# EAGLE design source_eagle (EAGLE 9.6.2)
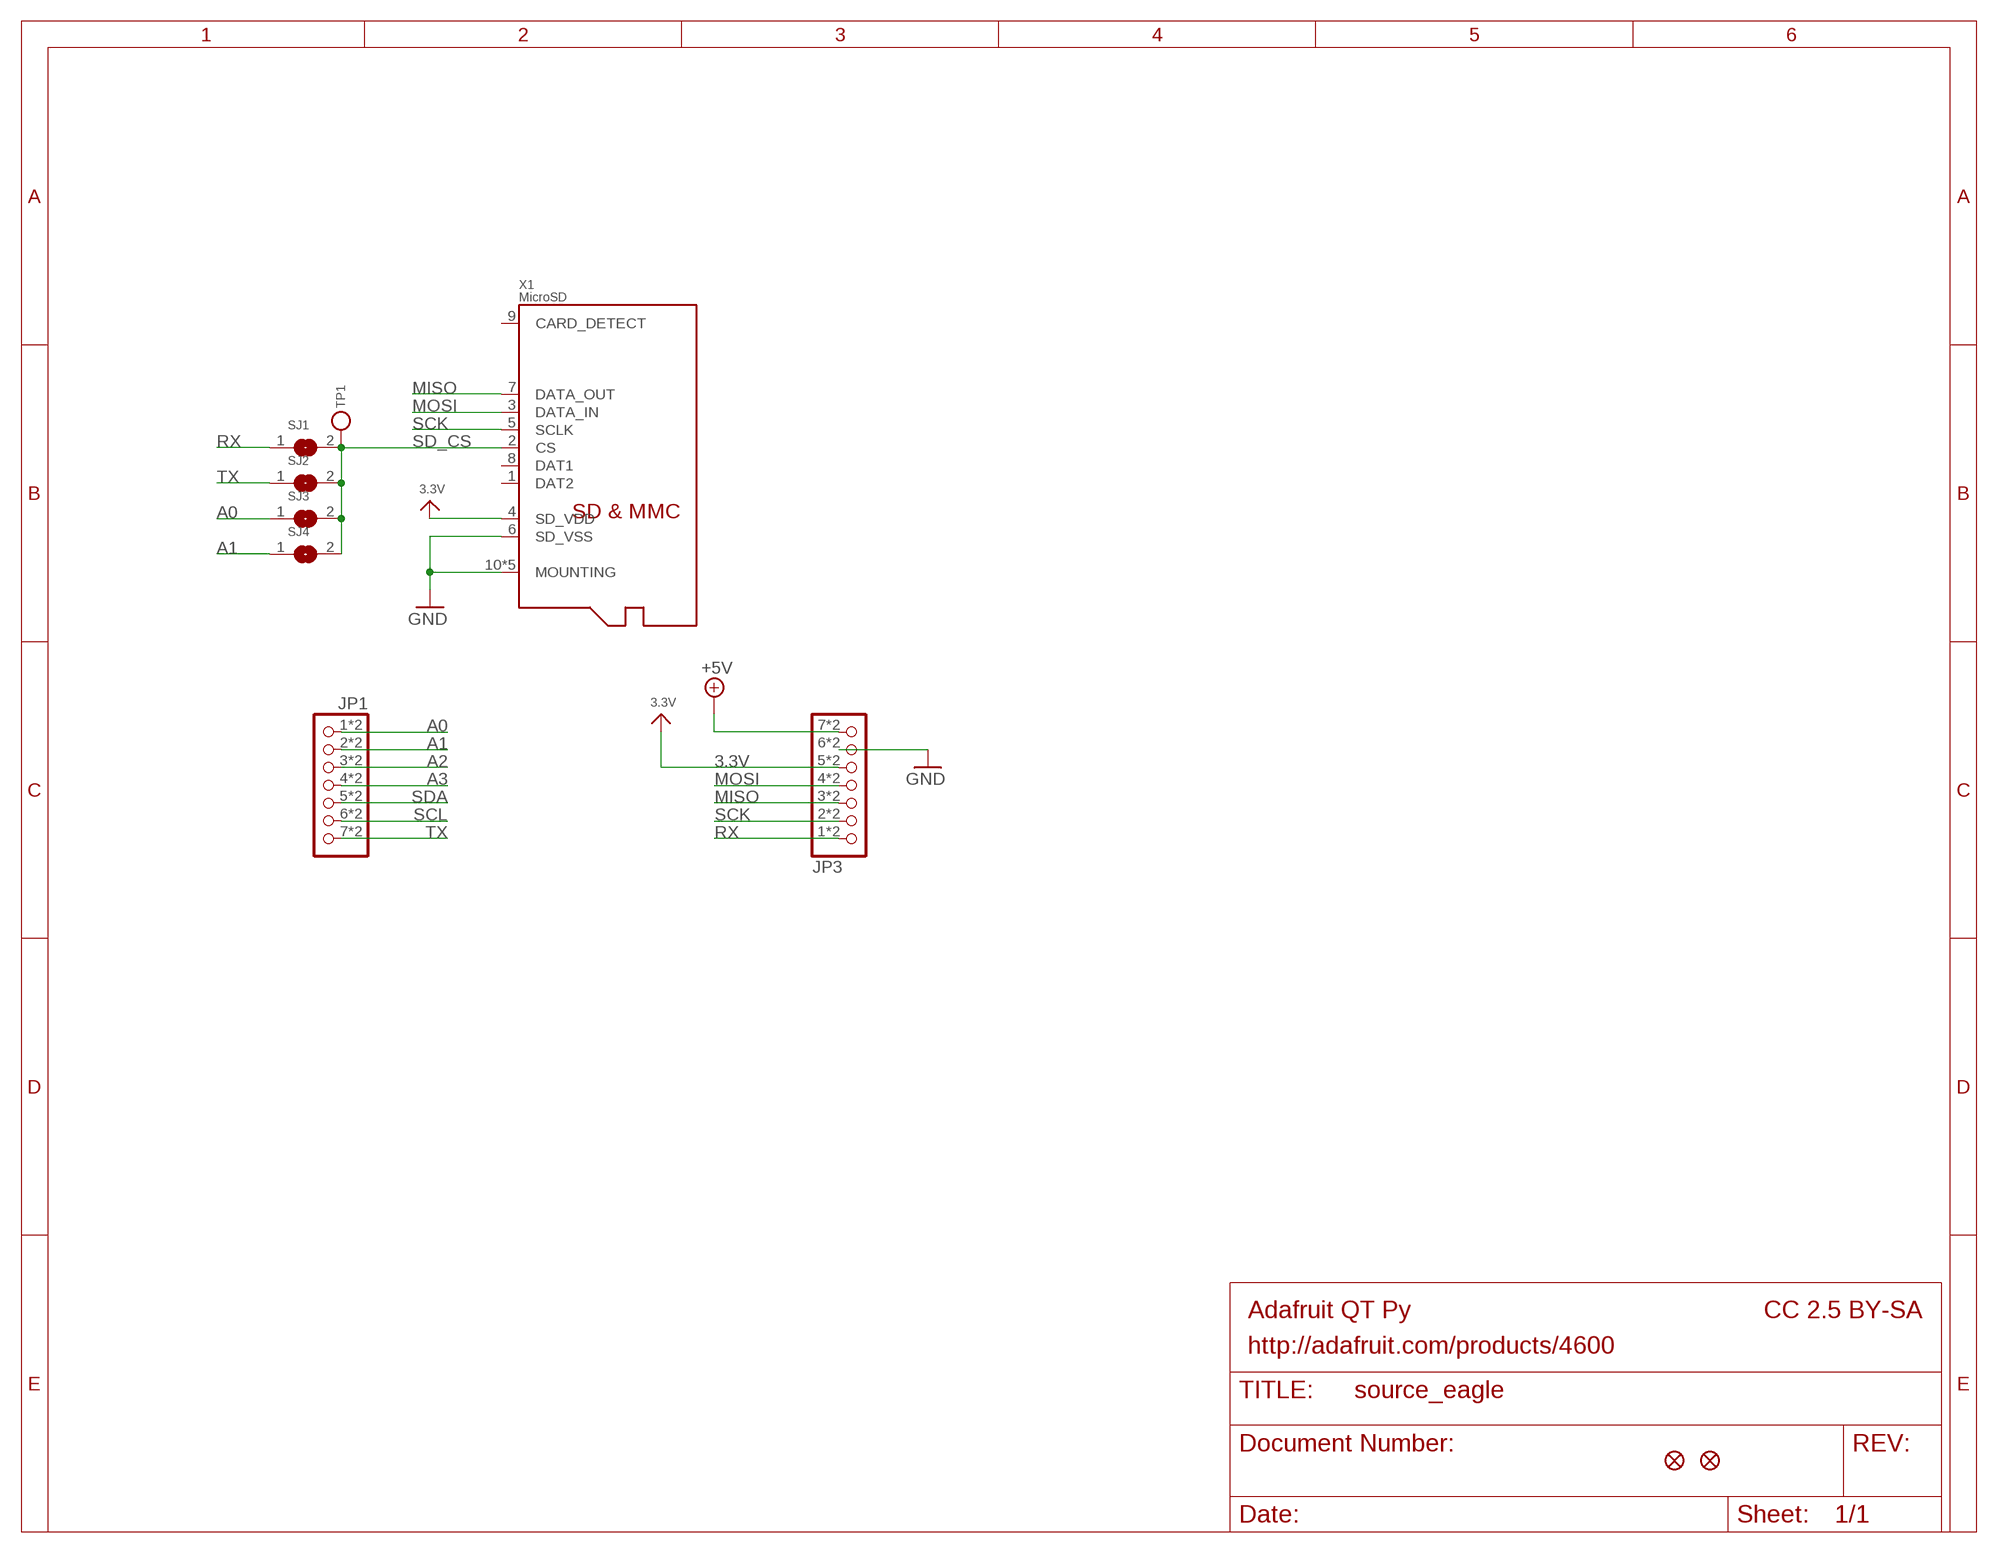
[diagram p0: schematic, sheet 1]

## Parts
JP1  HEADER-1X7_CASTEL  [1X07_CASTEL]
JP3  HEADER-1X7_CASTEL  [1X07_CASTEL]
SJ1  SOLDERJUMPER  [SOLDERJUMPER_ARROW_NOPASTE]
SJ2  SOLDERJUMPERCLOSED  [SOLDERJUMPER_CLOSEDWIRE]
SJ3  SOLDERJUMPER  [SOLDERJUMPER_ARROW_NOPASTE]
SJ4  SOLDERJUMPER  [SOLDERJUMPER_ARROW_NOPASTE]
TP1  TESTPOINTPAD1MM  [TESTPOINT_PAD_1MM]
U$6  FIDUCIAL_1MM  [FIDUCIAL_1MM]
U$8  FIDUCIAL_1MM  [FIDUCIAL_1MM]
X1  MicroSD  MICROSD104031-0811  [MOLEX_104031-0811]

## Nets
3.3V: JP3.5 JP3.5C X1.4(SD_VDD)
+5V [power]: JP3.7 JP3.7C
A0: JP1.1 JP1.1C SJ3.1
A1: JP1.2 JP1.2C SJ4.1
A2: JP1.3 JP1.3C
A3: JP1.4 JP1.4C
GND [power]: JP3.6 JP3.6C X1.6(SD_VSS) X1.10(MOUNTING) X1.G1(MOUNTING) X1.G2(MOUNTING) X1.G3(MOUNTING) X1.G4(MOUNTING)
MISO: JP3.3 JP3.3C X1.7(DATA_OUT)
MOSI: JP3.4 JP3.4C X1.3(DATA_IN)
RX: JP3.1 JP3.1C SJ1.1
SCK: JP3.2 JP3.2C X1.5(SCLK)
SCL: JP1.6 JP1.6C
SD_CS: SJ1.2 SJ2.2 SJ3.2 SJ4.2 TP1.P$1 X1.2(CS)
SDA: JP1.5 JP1.5C
TX: JP1.7 JP1.7C SJ2.1
Unconnected: X1.1(DAT2) X1.8(DAT1) X1.9(CARD_DETECT)

## Notes on the sheet
- Adafruit QT Py | CC 2.5 BY-SA
- http://adafruit.com/products/4600

## Library data of the parts
JP1 JP3 = adafruit_electromech:HEADER-1X7: PIN HEADER
SJ1 SJ3 SJ4 = microbuilder:SOLDERJUMPER: SMD Solder JUMPER Solder the two pads together to create a connection, or remove the solder to break it. REFLOW - Use this footprint for solder paste and reflow ovens. WAVE - Use this footprint for hand-soldering (larger pads). CLOSED - Has a trace between the two pads to ensure it is closed by default. The trace needs to be cut to disable the jumper, and can be closed again by creating a solder bridge between the two pads.; BOM: EXCLUDE
SJ2 = microbuilder:SOLDERJUMPER: SMD Solder JUMPER Solder the two pads together to create a connection, or remove the solder to break it. REFLOW - Use this footprint for solder paste and reflow ovens. WAVE - Use this footprint for hand-soldering (larger pads). CLOSED - Has a trace between the two pads to ensure it is closed by default. The trace needs to be cut to disable the jumper, and can be closed again by creating a solder bridge between the two pads.
TP1 = microbuilder:TESTPOINT: Test Point Various test points for characterisation and PCB testing TESTPOINT_SMT - Compact Surface Mount Test Point [Digikey: 5016KTR-ND]
U$6 U$8 = microbuilder:FIDUCIAL: Fiducial Alignment Points Various fiducial points for machine vision alignment.; BOM: EXCLUDE
X1 = adafruit_electromech:MICROSD: MicroSD/Transflash Card Holder with SPI pinout 3M: 2908-05WB-MG 4UConnector: 19656 Footprint courtesy: Adafruit Industries

## Net classes
1 power: width 0.305 mm
2 thickpower: width 0.406 mm

## Board
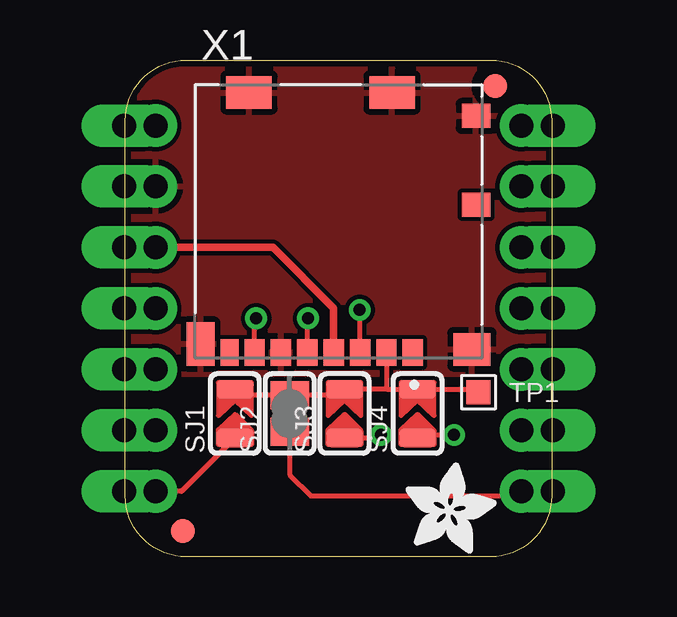
[diagram p1: board, top side]
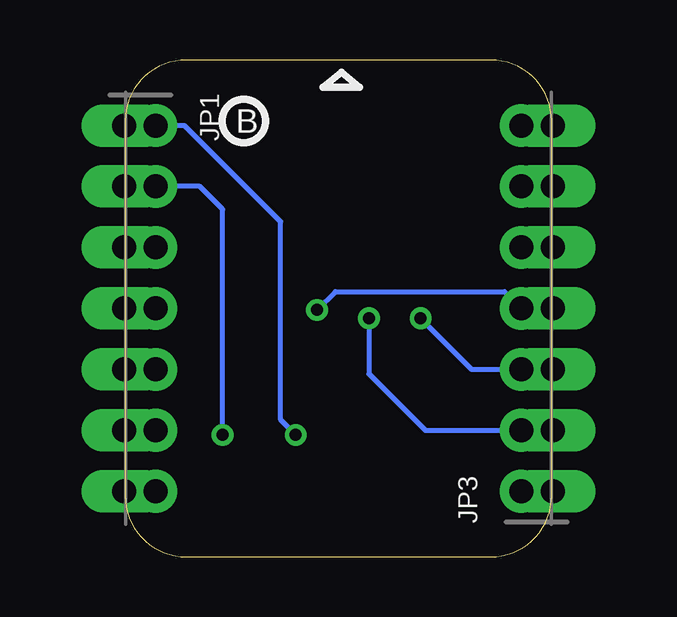
[diagram p2: board, bottom side, seen from below]

Size 17.78 x 20.7 mm. Coordinates in mm from the lower left corner, seen from the top.
Outline: 17.78,18.16 17.78,2.54 arc-90 15.24,0 2.54,0 arc-90 0,2.54 0,18.16 arc-90 2.54,20.7 15.24,20.7 arc-90 17.78,18.16
Copper layers (1*16): Top 0.035mm / dielectric 1.5mm / Bottom 0.035mm
Design rules "adafruit 7-7": minimum track width 7mil, minimum drill 15.5mil, track to track 7mil, track to pad 7mil, pad to pad 7mil, via to via 7mil, smd to smd 7mil, copper to edge 10mil, drill to drill 8mil, minimum pad ring 7mil, minimum via ring 8mil, stop-mask expansion 2mil, vias tented up to drill 20mil, thermal gap 10mil

### Footprints (pad centres in the part's own frame; a part is rotated, then mirrored left to right if it is on the bottom)
1X07_CASTEL = drill 1 pad 1.778: 1 -7.62,0; 2 -5.08,0; 3 -2.54,0; 4 0,0; 5 2.54,0; 6 5.08,0; 7 7.62,0 | drill 1 pad 1.778 long: 1C -7.62,-1.324; 2C -5.08,-1.324; 3C -2.54,-1.324; 4C 0,-1.324; 5C 2.54,-1.324; 6C 5.08,-1.324; 7C 7.62,-1.324
SOLDERJUMPER_ARROW_NOPASTE = smd 0.762 x 1.524: 1 -1.016,0; 2 1.016,0
SOLDERJUMPER_CLOSEDWIRE = smd 1.168 x 1.6: 1 -0.762,0; 2 0.762,0 | smd 0.635 x 0.203: WIRE 0,0
TESTPOINT_PAD_1MM = smd 1 x 1: P$1 0,0
FIDUCIAL_1MM = smd 1 x 1: 1 0,0
MOLEX_104031-0811 = smd 0.85 x 1.1: 1 3.105,-5.45; 2 2.005,-5.45; 3 0.905,-5.45; 4 -0.195,-5.45; 5 -1.295,-5.45; 6 -2.395,-5.45; 7 -3.495,-5.45 | smd 0.75 x 1.1: 8 -4.545,-5.45 | smd 1.2 x 1: 9 5.74,0.7; 10 5.74,4.4 | smd 1.55 x 1.35: G1 5.565,-5.325 | smd 1.17 x 1.8: G2 -5.755,-5.1 | smd 1.9 x 1.35: G3 -3.73,5.375; G4 2.24,5.375

### Placement (x,y rotation side)
JP1  16.51,10.35 270 bottom
JP3  1.27,10.35 90 bottom
PLABEL0  [PLABEL0]  6.86,3.56 0 top
PLABEL1  [PLABEL1]  4.57,3.56 0 top
PLABEL2  [PLABEL2]  9.14,3.56 0 top
PLABEL3  [PLABEL3]  12.19,3.56 0 top
PLABEL4  [PLABEL4]  5.71,0.13 0 top
PLABEL5  [PLABEL5]  14.73,5.08 90 top
PLABEL6  [PLABEL6]  8.76,18.16 0 bottom
PLABEL7  [PLABEL7]  8.76,10.41 0 bottom
SJ1  4.57,5.97 90 top
SJ2  6.86,5.97 90 top
SJ3  9.14,5.97 90 top
SJ4  12.19,5.97 90 top
TP1  14.73,6.86 0 top
U$2  [ADAFRUIT_3.5MM]  11.68,0.13 0 top
U$3  [PCBFEAT-REV-040]  12.83,18.16 0 bottom
U$6  2.4,1.08 180 top
U$8  15.43,19.62 180 top
X1  8.89,13.97 0 top

### Tracks (layer width: path | path; a pad name or v marks a point on that pad's centre or on a via)
3.3V
  Top 0.305: JP3.5 6.16,12.89 8.7,10.36 X1.4
  Bottom 0.305: JP3.5C JP3.5
+5V
  Bottom 0.305: JP3.7C JP3.7
A0  (via drill 0.5)
  Top 0.203: SJ3.1 10.54,4.95 v10.67,5.08
  Bottom 0.203: v10.67,5.08 11.3,5.71 11.3,13.97 15.3,17.97 JP1.1
  Bottom 0.305: JP1.1C JP1.1
A1  (via drill 0.5)
  Top 0.203: SJ4.1 12.32,5.08 v13.72,5.08
  Bottom 0.203: v13.72,5.08 13.72,14.48 14.67,15.43 JP1.2
  Bottom 0.305: JP1.2C JP1.2
A2
  Bottom 0.305: JP1.3C JP1.3
A3
  Bottom 0.305: JP1.4C JP1.4
GND
  Bottom 0.305: JP3.6C JP3.6
  pour Top: 17.65,20.7 0.13,20.7 0.13,7.62 17.65,7.62
MISO  (via drill 0.5)
  Top 0.203: X1.7 5.39,9.87 v5.46,9.94
  Bottom 0.203: v5.46,9.94 3.34,7.81 JP3.3
  Bottom 0.305: JP3.3C JP3.3
MOSI  (via drill 0.5)
  Top 0.203: X1.3 9.79,10.27 v9.78,10.29
  Bottom 0.203: JP3.4 1.97,11.05 9.02,11.05 v9.78,10.29
  Bottom 0.305: JP3.4C JP3.4
RX
  Top 0.203: SJ1.1 2.35,2.73 JP3.1
  Bottom 0.305: JP3.1C JP3.1
SCK  (via drill 0.5)
  Top 0.203: X1.5 7.59,9.91 v7.62,9.94
  Bottom 0.203: v7.62,9.94 7.62,7.62 5.27,5.27 JP3.2
  Bottom 0.305: JP3.2C 0.45,5.27 0.64,5.08 1.08,5.08 JP3.2
SCL
  Bottom 0.305: JP1.6C JP1.6
SD_CS
  Top 0.203: X1.2 10.89,7.01 | 10.89,7.01 10.92,6.99 SJ4.2 14.61,6.99 TP1.P$1 | 10.89,7.01 10.87,6.99 SJ3.2 8.89,6.73 SJ2.2 4.83,6.73 SJ1.2
SDA
  Bottom 0.305: JP1.5C JP1.5
TX
  Top 0.203: SJ2.1 6.86,3.43 7.75,2.54 16.32,2.54 JP1.7
  Bottom 0.305: JP1.7C JP1.7

### Text on the board
Pinguin_tBackup: 5V | A0 | NP | Sw | CS | RX | TX | A0 | A1 | RX | BFF | TX | MicroSD / BFF
Pinguin_bBackup: USB | MicroSD Card / SPI interface + / Card CS on TX / QT Py. Solder / back to / back